# EAGLE board openbook (EAGLE 9.7.0)
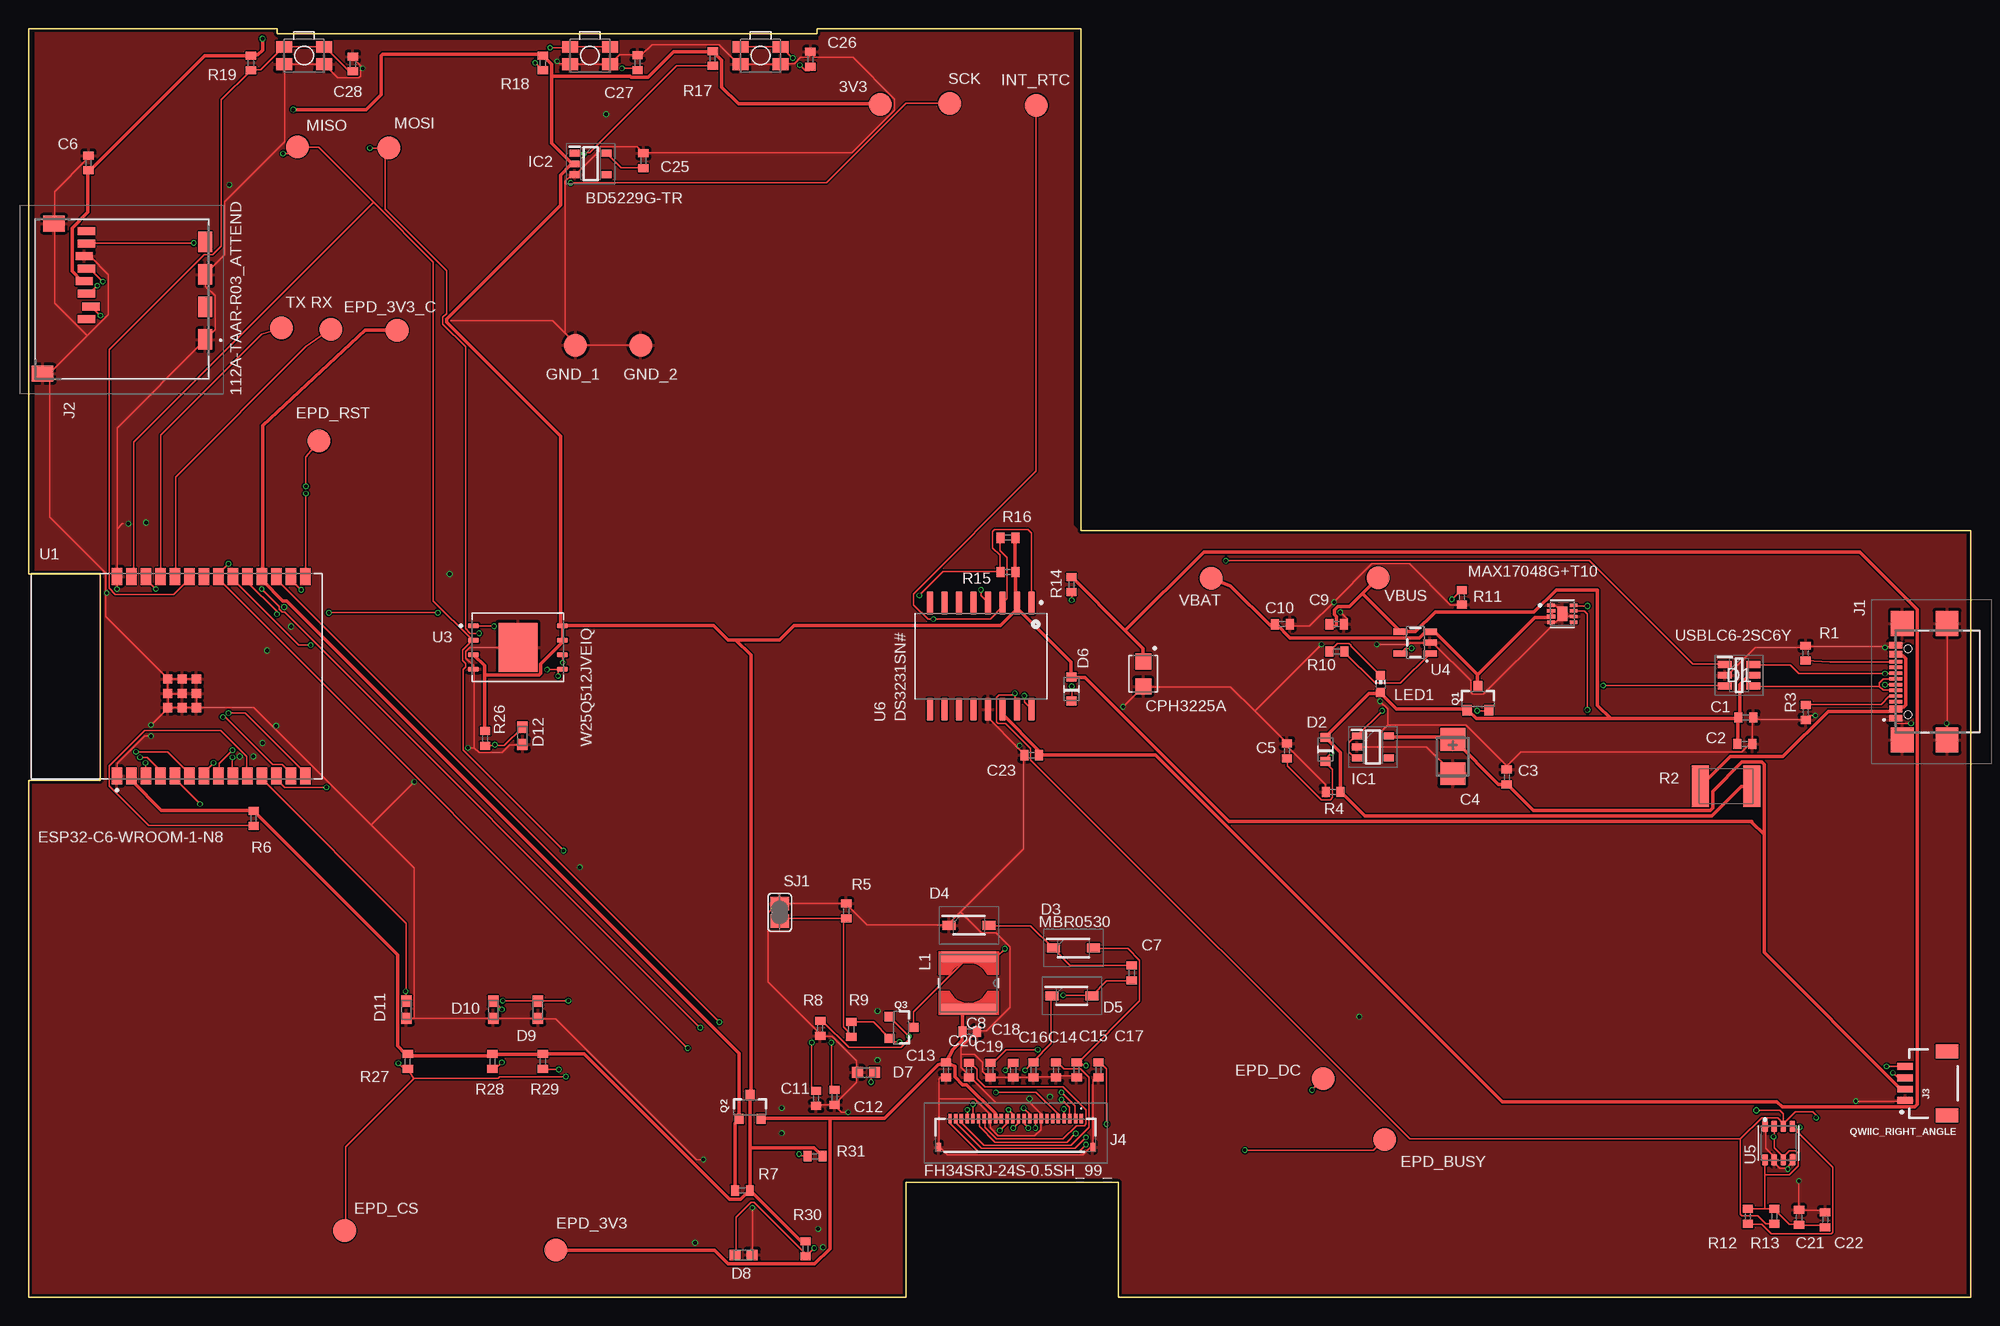
[diagram p1: board, top side]
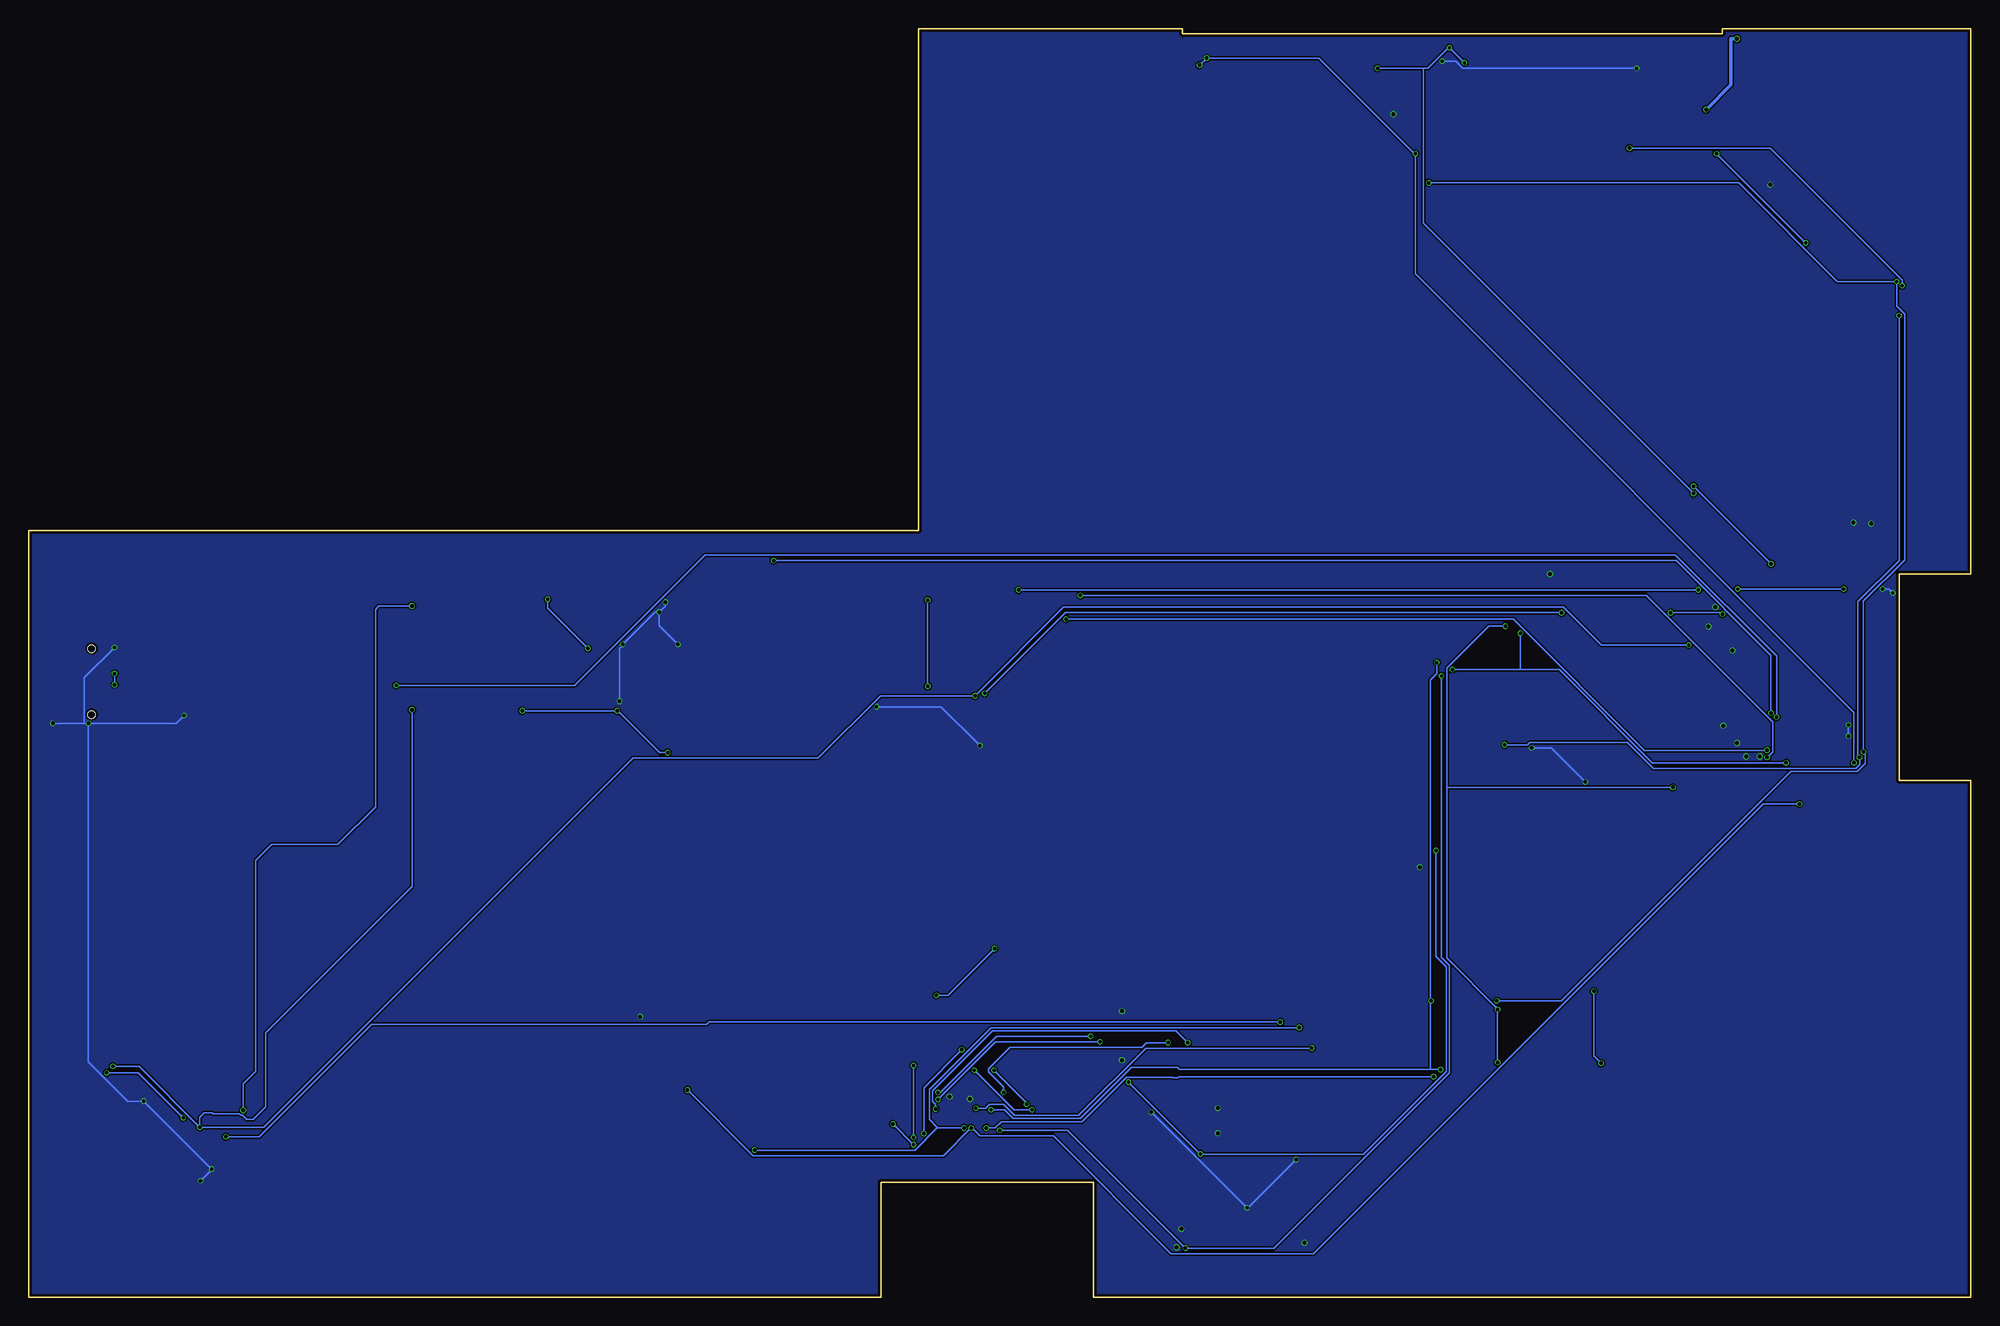
[diagram p2: board, bottom side, seen from below]

Size 170.2 x 111.2 mm. Coordinates in mm from the lower left corner, seen from the top.
Outline: 170.2,67.2 92.2,67.2 92.2,111.2 69.1,111.2 69.1,110.75 21.8,110.75 21.8,111.2 0,111.2 0,63.4 6.3,63.4 6.3,45.3 0,45.3 0,0 76.9,0 76.9,10.1 95.5,10.1 95.5,0 170.2,0 170.2,67.2
Copper layers (1*16): Top 0.035mm / dielectric 1.6mm / Bottom 0.035mm
Design rules "jlcpcb-2layers.dru *": minimum track width 5mil, minimum drill 0.3mm, track to track 5mil, track to pad 5mil, pad to pad 5mil, via to via 5mil, smd to smd 5mil, copper to edge 0.2mm, drill to drill 6mil, minimum pad ring 10mil, minimum via ring 3mil, stop-mask expansion 4mil, vias tented up to drill 0mil, thermal gap 10mil
Net classes: 0 default: width 0.15 mm; 1 POWER: width 0.3 mm

## Footprints (pad centres in the part's own frame; a part is rotated, then mirrored left to right if it is on the bottom)
EAGLE-LTSPICE_C0402 = smd 0.7 x 0.9: 1 -0.65,0; 2 0.65,0
RCL_CT3528 = smd 2 x 2.2: + -1.5,0; - 1.5,0
CAPCP3225X100N = smd 1.4 x 1.4: 1 -1.1,0; 2 1.1,0
SOT95P280X145-6N = smd 1.2 x 0.6: 1 -1.25,0.95; 2 -1.25,0; 3 -1.25,-0.95; 4 1.25,-0.95; 5 1.25,0; 6 1.25,0.95
ESP32_WROVER_AVX---SD0805S020S1R0_AVX_SD0805S020S1R0_0 = smd 0.8 x 0.9: 1 -1.05,0; 2 1.05,0
SOD3716X135N = smd 1.15 x 0.8: 1 -1.75,0; 2 1.75,0
DIOC1608X36N = smd 0.97 x 0.94: 1 -0.75,0; 2 0.75,0
SOT95P280X120-5N = smd 0.9 x 0.6: 1 -1.4,0.95; 2 -1.4,0; 3 -1.4,-0.95; 4 1.4,-0.95; 5 1.4,0.95
SOT95P280X125-5N = smd 0.9 x 0.6: 1 -1.4,0.95; 2 -1.4,0; 3 -1.4,-0.95; 4 1.4,-0.95; 5 1.4,0.95
SAMACSYS_PARTS_USB4110GFA = smd 0.3 x 1.15: A1 -3.35,3.678; A4 -2.55,3.678; A5 -1.25,3.678; A6 -0.25,3.678; A7 0.25,3.678; A8 1.25,3.678; A9 2.55,3.678; A12 3.35,3.678; B1 3.05,3.678; B4 2.25,3.678; B5 1.75,3.678; B6 0.75,3.678; B7 -0.75,3.678; B8 -1.75,3.678; B9 -2.25,3.678; B12 -3.05,3.678 | smd 2.18 x 2: MP1 -5.11,-0.827; MP2 5.11,-0.827; MP3 -5.11,3.103; MP4 5.11,3.103 | hole 0.65: -2.89,2.603; 2.89,2.603
112ATAARR03ATTEND = smd 1.8 x 1.2: G1 10.6,10.4; G2 4.9,10.4; S1 7.75,10.4; S2 2.05,10.4 | smd 1.4 x 1.9: G3 13.6,-3.85; G4 0.45,-2.85 | smd 0.7 x 1.5: P1 8.8,0; P2 7.7,0.4; P3 6.6,0; P4 5.5,-0.2; P5 4.4,0; P6 3.3,-0.2; P7 2.2,0; P8 1.1,0
JST04_1MM_RA = smd 0.6 x 1.35: 1 -1.5,0; 2 -0.5,0; 3 0.5,0; 4 1.5,0 | smd 1.2 x 2: NC1 2.8,-3.675; NC2 -2.8,-3.675
FH34SRJ24S05SH99 = smd 0.3 x 0.8: 1 5.75,1.45; 2 5.25,1.45; 3 4.75,1.45; 4 4.25,1.45; 5 3.75,1.45; 6 3.25,1.45; 7 2.75,1.45; 8 2.25,1.45; 9 1.75,1.45; 10 1.25,1.45; 11 0.75,1.45; 12 0.25,1.45; 13 -0.25,1.45; 14 -0.75,1.45; 15 -1.25,1.45; 16 -1.75,1.45; 17 -2.25,1.45; 18 -2.75,1.45; 19 -3.25,1.45; 20 -3.75,1.45; 21 -4.25,1.45; 22 -4.75,1.45; 23 -5.25,1.45; 24 -5.75,1.45 | smd 0.4 x 0.8: MP1 6.75,-1.05; MP2 -6.75,-1.05
IND_4828-WE-TPC_WRE = smd 0.889 x 4.826: 1 -2.286,0; 2 2.286,0
ADAFRUIT_CHIP-LED0603 = smd 0.8 x 0.8: A 0,-0.75; C 0,0.75
ESP32_WROVER_SPARKFUN-DISCRETESEMI_SOT23-3 = smd 0.8 x 0.9: 1 -0.95,-1; 2 0.95,-1; 3 0,1.1
ESP32_WROVER_EAGLE-LTSPICE_R0402 = smd 0.7 x 0.9: 1 -0.65,0; 2 0.65,0
ESP32C6_VARISTOR_CT/CN1812 = smd 1.5 x 3.6: 1 -2.25,0; 2 2.25,0
SJ = smd 1.168 x 1.6: 1 -0.762,0; 2 0.762,0
TP20R = smd 2 x 2: TP 0,0
XCVR_ESP32-C6-WROOM-1-N8 = smd 1.5 x 0.9: 1 -8.75,5.26; 2 -8.75,3.99; 3 -8.75,2.72; 4 -8.75,1.45; 5 -8.75,0.18; 6 -8.75,-1.09; 7 -8.75,-2.36; 8 -8.75,-3.63; 9 -8.75,-4.9; 10 -8.75,-6.17; 11 -8.75,-7.44; 12 -8.75,-8.71; 13 -8.75,-9.98; 14 -8.75,-11.25; 15 8.75,-11.25; 16 8.75,-9.98; 17 8.75,-8.71; 18 8.75,-7.44; 19 8.75,-6.17; 20 8.75,-4.9; 21 8.75,-3.63; 22 8.75,-2.36; 23 8.75,-1.09; 24 8.75,0.18; 25 8.75,1.45; 26 8.75,2.72; 27 8.75,3.99; 28 8.75,5.26 | smd 0.8 x 0.8: 29_1 -2.755,0.79; 29_2 -1.505,0.79; 29_3 -0.255,0.79; 29_4 -2.755,-0.46; 29_5 -1.505,-0.46; 29_6 -0.255,-0.46; 29_7 -2.755,-1.71; 29_8 -1.505,-1.71; 29_9 -0.255,-1.71
SON50P200X200X80-9N = smd 0.76 x 0.27: 1 -0.985,0.75; 4 -0.985,-0.75; 5 0.985,-0.75; 6 0.985,-0.25; 7 0.985,0.25; 8 0.985,0.75 | smd 0.813 x 0.305: 2 -0.985,0.25; 3 -0.985,-0.25 | smd 0.9 x 1.3: 9 0,0
SON127P600X800X80-9N = smd 0.94 x 0.44: 1 -3.895,1.905; 2 -3.895,0.635; 3 -3.895,-0.635; 4 -3.895,-1.905; 5 3.895,-1.905; 6 3.895,-0.635; 7 3.895,0.635; 8 3.895,1.905 | smd 3.4 x 4.3: 9 0,0
ESP32_WROVER_SPARKFUN-IC-POWER_SOT23-5 = smd 0.55 x 1.2: 1 -0.95,-1.3; 2 0,-1.3; 3 0.95,-1.3; 4 0.95,1.3; 5 -0.95,1.3
ESP32_WROVER_BME680_PSON80P300X300X100-8N = smd 1.016 x 0.5: 1 1.458,1.2; 2 1.458,0.4; 3 1.458,-0.4; 4 1.458,-1.2; 5 -1.458,-1.22; 6 -1.458,-0.4; 7 -1.458,0.4; 8 -1.458,1.2
SOIC127P1032X265-16N = smd 2.05 x 0.59: 1 -4.655,4.445; 2 -4.655,3.175; 3 -4.655,1.905; 4 -4.655,0.635; 5 -4.655,-0.635; 6 -4.655,-1.905; 7 -4.655,-3.175; 8 -4.655,-4.445; 9 4.655,-4.445; 10 4.655,-3.175; 11 4.655,-1.905; 12 4.655,-0.635; 13 4.655,0.635; 14 4.655,1.905; 15 4.655,3.175; 16 4.655,4.445
MYBUTTON = smd 1.4 x 1.05: 1 1.75,0.75; 2 -1.75,0.75; 3 -1.75,-0.75; 4 1.75,-0.75

## Placement (x,y rotation side)
C1  100nF  [EAGLE-LTSPICE_C0402]  150.48,50.82 0 top
C2  4.7uF  [EAGLE-LTSPICE_C0402]  150.37,48.5 0 top
C3  4.7uF  [EAGLE-LTSPICE_C0402]  129.52,45.6 90 top
C4  100uF  [RCL_CT3528]  124.79,47.4 270 top
C5  4.7uF  [EAGLE-LTSPICE_C0402]  110.27,47.9 90 top
C6  100nF  [EAGLE-LTSPICE_C0402]  5.26,99.42 90 top
C7  4.7uF/25V  [EAGLE-LTSPICE_C0402]  96.66,28.44 270 top
C8  10uF  [EAGLE-LTSPICE_C0402]  82.47,23.3 0 top
C9  4.7uF  [EAGLE-LTSPICE_C0402]  114.62,59 0 top
C10  4.7uF  [EAGLE-LTSPICE_C0402]  109.87,59 0 top
C11  1uF/50V  [EAGLE-LTSPICE_C0402]  69.01,17.44 90 top
C12  1uF/50V  [EAGLE-LTSPICE_C0402]  70.62,17.54 90 top
C13  0.1uF/50V  [EAGLE-LTSPICE_C0402]  80.4,19.94 90 top
C14  1uF/50V  [EAGLE-LTSPICE_C0402]  90.03,19.94 90 top
C15  1uF/50V  [EAGLE-LTSPICE_C0402]  91.84,19.94 90 top
C16  1uF/50V  [EAGLE-LTSPICE_C0402]  88.05,19.94 90 top
C17  1uF/50V  [EAGLE-LTSPICE_C0402]  93.76,19.94 90 top
C18  1uF/50V  [EAGLE-LTSPICE_C0402]  86.28,19.92 90 top
C19  1uF/50V  [EAGLE-LTSPICE_C0402]  84.29,19.92 90 top
C20  1uF/50V  [EAGLE-LTSPICE_C0402]  82.4,19.92 90 top
C21  100nF  [EAGLE-LTSPICE_C0402]  155.14,7.02 90 top
C22  100nF  [EAGLE-LTSPICE_C0402]  157.42,6.82 90 top
C23  100nF  [EAGLE-LTSPICE_C0402]  87.9,47.52 180 top
C24  CPH3225A  [CAPCP3225X100N]  97.69,54.64 270 top
C25  100nF  [EAGLE-LTSPICE_C0402]  53.88,99.62 90 top
C26  1uF  [EAGLE-LTSPICE_C0402]  68.51,108.5 90 top
C27  100nF  [EAGLE-LTSPICE_C0402]  53.36,108.21 90 top
C28  100nF  [EAGLE-LTSPICE_C0402]  28.42,108.1 90 top
D1  USBLC6-2SC6Y  [SOT95P280X145-6N]  149.88,54.52 0 top
D2  ESP32_WROVER_AVX---SD0805S020S1R0_AVX_SD0805S020S1R0_0_0AVX_SD0805S020S1R0_0_0  [ESP32_WROVER_AVX---SD0805S020S1R0_AVX_SD0805S020S1R0_0]  113.63,48.03 90 top
D3  MBR0530  [SOD3716X135N]  91.56,30.62 0 top
D4  MBR0530  [SOD3716X135N]  82.4,32.62 0 top
D5  MBR0530  [SOD3716X135N]  91.42,26.43 0 top
D6  ESP32_WROVER_AVX---SD0805S020S1R0_AVX_SD0805S020S1R0_0_0AVX_SD0805S020S1R0_0_0  [ESP32_WROVER_AVX---SD0805S020S1R0_AVX_SD0805S020S1R0_0]  91.38,53.33 90 top
D7  PGB1010603MR  [DIOC1608X36N]  73.38,19.72 0 top
D8  PGB1010603MR  [DIOC1608X36N]  62.66,3.72 180 top
D9  PGB1010603MR  [DIOC1608X36N]  44.64,25.22 90 top
D10  PGB1010603MR  [DIOC1608X36N]  40.72,25.22 90 top
D11  PGB1010603MR  [DIOC1608X36N]  33.1,25.22 90 top
D12  PGB1010603MR  [DIOC1608X36N]  43.28,49.22 90 top
IC1  XC6220A331MR-G  [SOT95P280X120-5N]  117.79,48.24 0 top
IC2  BD5229G-TR  [SOT95P280X125-5N]  49.25,99.34 0 top
J1  SAMACSYS_PARTS_USB4110-GF-A  [SAMACSYS_PARTS_USB4110GFA]  167.28,53.96 90 top
J2  112A-TAAR-R03_ATTEND  [112ATAARR03ATTEND]  5.08,94.55 270 top
J3  QWIIC_RIGHT_ANGLE  [JST04_1MM_RA]  164.43,18.76 90 top
J4  FH34SRJ-24S-0.5SH_99_  [FH34SRJ24S05SH99]  86.49,14.22 0 top
L1  68uH  [IND_4828-WE-TPC_WRE]  82.37,27.55 270 top
LED1  [ADAFRUIT_CHIP-LED0603]  118.46,53.75 0 top
Q1  20V/4.2A/52mΩ/1.4W  [ESP32_WROVER_SPARKFUN-DISCRETESEMI_SOT23-3]  127,52.46 0 top
Q2  20V/4.2A/52mΩ/1.4W  [ESP32_WROVER_SPARKFUN-DISCRETESEMI_SOT23-3]  63.22,16.66 0 top
Q3  20V/4.2A/52mΩ/1.4W  [ESP32_WROVER_SPARKFUN-DISCRETESEMI_SOT23-3]  76.44,23.66 270 top
R1  5k1  [ESP32_WROVER_EAGLE-LTSPICE_R0402]  155.71,56.46 90 top
R2  ESP32C6_VARISTORCN1812  [ESP32C6_VARISTOR_CT/CN1812]  148.74,44.8 0 top
R3  5k1  [ESP32_WROVER_EAGLE-LTSPICE_R0402]  155.73,51.26 90 top
R4  100K  [ESP32_WROVER_EAGLE-LTSPICE_R0402]  114.32,44.3 0 top
R5  2.2  [ESP32_WROVER_EAGLE-LTSPICE_R0402]  71.65,33.86 270 top
R6  10K  [ESP32_WROVER_EAGLE-LTSPICE_R0402]  19.73,41.98 90 top
R7  10K  [ESP32_WROVER_EAGLE-LTSPICE_R0402]  62.55,9.38 0 top
R8  10K  [ESP32_WROVER_EAGLE-LTSPICE_R0402]  69.37,23.58 90 top
R9  0.47  [ESP32_WROVER_EAGLE-LTSPICE_R0402]  72.09,23.5 90 top
R10  200  [ESP32_WROVER_EAGLE-LTSPICE_R0402]  114.63,56.6 0 top
R11  2K  [ESP32_WROVER_EAGLE-LTSPICE_R0402]  125.59,61.36 90 top
R12  10K  [ESP32_WROVER_EAGLE-LTSPICE_R0402]  150.65,7.1 90 top
R13  10K  [ESP32_WROVER_EAGLE-LTSPICE_R0402]  152.97,7.1 90 top
R14  15  [ESP32_WROVER_EAGLE-LTSPICE_R0402]  91.39,62.48 90 top
R15  10K  [ESP32_WROVER_EAGLE-LTSPICE_R0402]  85.81,63.58 0 top
R16  10K  [ESP32_WROVER_EAGLE-LTSPICE_R0402]  85.83,66.58 0 top
R17  10K  [ESP32_WROVER_EAGLE-LTSPICE_R0402]  59.95,108.58 90 top
R18  10K  [ESP32_WROVER_EAGLE-LTSPICE_R0402]  45.07,108.18 90 top
R19  10K  [ESP32_WROVER_EAGLE-LTSPICE_R0402]  19.49,108.18 90 top
R26  10K  [ESP32_WROVER_EAGLE-LTSPICE_R0402]  40.01,48.98 90 top
R27  10K  [ESP32_WROVER_EAGLE-LTSPICE_R0402]  33.23,20.68 90 top
R28  10K  [ESP32_WROVER_EAGLE-LTSPICE_R0402]  40.65,20.68 90 top
R29  10K  [ESP32_WROVER_EAGLE-LTSPICE_R0402]  45.07,20.68 90 top
R30  10K  [ESP32_WROVER_EAGLE-LTSPICE_R0402]  68.09,4.28 90 top
R31  10K  [ESP32_WROVER_EAGLE-LTSPICE_R0402]  68.91,12.38 0 top
SJ1  [SJ]  65.82,33.74 270 top
TP1  TPTP20R  [TP20R]  22.17,84.96 0 top
TP2  TPTP20R  [TP20R]  26.49,84.84 0 top
TP3  TPTP20R  [TP20R]  103.61,63.04 0 top
TP4  TPTP20R  [TP20R]  47.93,83.44 0 top
TP5  TPTP20R  [TP20R]  53.65,83.44 0 top
TP6  TPTP20R  [TP20R]  23.57,100.84 0 top
TP7  TPTP20R  [TP20R]  31.59,100.74 0 top
TP8  TPTP20R  [TP20R]  80.71,104.64 0 top
TP9  TPTP20R  [TP20R]  118.83,13.84 0 top
TP10  TPTP20R  [TP20R]  27.7,5.86 0 top
TP11  TPTP20R  [TP20R]  113.45,19.16 0 top
TP12  TPTP20R  [TP20R]  25.45,75.06 0 top
TP13  TPTP20R  [TP20R]  32.3,84.76 0 top
TP14  TPTP20R  [TP20R]  118.25,63.06 0 top
TP15  TPTP20R  [TP20R]  88.3,104.46 0 top
TP16  TPTP20R  [TP20R]  74.65,104.56 0 top
TP17  TPTP20R  [TP20R]  46.2,4.16 0 top
U1  ESP32-C6-WROOM-1-N8  [XCVR_ESP32-C6-WROOM-1-N8]  13,54.44 90 top
U2  MAX17048G+T10  [SON50P200X200X80-9N]  134.4,59.92 0 top
U3  W25Q512JVEIQ  [SON127P600X800X80-9N]  42.89,56.96 0 top
U4  ESP32_WROVER_SPARKFUN-IC-POWER_MCP73831  [ESP32_WROVER_SPARKFUN-IC-POWER_SOT23-5]  121.51,57.39 90 top
U5  ESP32_WROVER_BME680_BME680  [ESP32_WROVER_BME680_PSON80P300X300X100-8N]  153.35,13.53 90 top
U6  DS3231SN#  [SOIC127P1032X265-16N]  83.45,56.2 270 top
U$1  BUTTON_CUSYOMV1  [MYBUTTON]  64.14,108.83 180 top
U$2  BUTTON_CUSYOMV1  [MYBUTTON]  49.19,108.83 180 top
U$3  BUTTON_CUSYOMV1  [MYBUTTON]  24.14,108.83 180 top

## Tracks (layer width: path | path; a pad name or v marks a point on that pad's centre or on a via)
3V3  (via drill 0.35)
  Top 0.3: J2.P4 4.85,89.09 4.64,89.09 3.81,89.92 3.81,93.73 5.19,95.11 5.19,98.71 C6.1 5.4,98.78 15.44,108.82 19.46,108.82 R19.2 19.6,108.89 20.08,108.89 20.5,109.31 v20.5,110.3 | 45.84,107.02 45.84,108.06 R18.2 44.97,108.93 31.03,108.93 30.9,108.8 30.9,105.4 29.6,104.1 v23.2,104.1 | 45.84,107.02 45.84,101.14 47.57,99.4 47.78,99.4 IC2.2 47.5,99.27 46.6,98.37 46.6,95.7 36.65,85.75 36.65,85.45 46.6,75.5 46.6,59.03 46.67,58.96 U3.8 | TP16.TP 74.65,104.6 62.19,104.6 60.73,106.06 60.73,108.41 60.04,109.1 R17.2 59.9,109.17 56.51,109.17 54.27,106.93 52.8,106.93 52.7,107.02 45.84,107.02 | IC1.5 119.25,49.13 124.58,49.13 124.79,48.92 C4.+ 124.93,48.85 128.8,44.97 129.5,44.97 C3.1 129.63,44.91 131.85,42.69 147.36,42.69 147.57,42.9 147.57,44.35 150.13,46.91 151.86,46.91 152.07,46.71 152.07,40.57 | 152.07,40.57 152.07,30.22 163.98,18.31 164.4,18.31 J3.2 | U3.8 46.81,58.82 46.81,57.65 U3.7 46.67,57.51 46.67,57.3 44.87,55.5 44.87,54.67 44.73,54.53 39.96,54.53 | 39.96,54.53 39.96,55.36 39.06,56.26 U3.3 | 39.96,54.53 39.96,49.68 R26.2 | U6.2 86.63,60.83 86.63,60.42 91.34,55.71 91.34,54.39 D6.2 91.48,54.32 92.59,54.32 105.19,41.72 151,41.72 151,41.64 152.07,40.57 | U6.2 86.49,60.9 86.49,63.53 R15.2 86.42,63.67 86.42,66.58 R16.2 | U3.8 46.95,58.89 60.02,58.89 61.28,57.62 61.95,57.62 | U6.2 86.56,60.28 85.18,58.89 67.09,58.89 65.82,57.62 61.95,57.62 | U1.2 9.07,45.67 9.07,45.25 11.63,42.69 19.66,42.69 R6.2 19.8,42.55 32.34,30.02 32.34,22.05 33.02,21.37 R27.2 33.55,21.15 40.64,21.15 R28.2 40.67,21.29 45.01,21.29 R29.2 45.22,21.36 48.68,21.36 61.42,8.62 62.39,8.62 63.09,9.31 R7.2
  Top 0.3: R30.2 68.07,4.95 67.66,4.95 63.22,9.38 R7.2 | 63.22,13.12 63.22,9.52 R7.2 | 63.22,13.12 Q2.3 63.29,17.9 63.29,56.28 61.95,57.62 | 63.22,13.12 68.83,13.12 69.53,12.43 R31.2
  Bottom 0.3: v23.2,104.1 21.03,106.27 21.03,110.3 v20.5,110.3
32KHZ  (via drill 0.3)
  Top 0.15: U6.1 87.88,60.9 87.88,66.97 87.57,67.27 84.62,67.27 84.48,67.13 84.48,65.68 85.11,65.06 85.11,63.6 R15.1 85.04,63.6 80.12,63.6 v78.04,61.53 | v17.87,47.33 17.87,45.74 U1.9
  Bottom 0.15: v17.87,47.33 17.38,47.81 17.38,50.45 28.46,61.53 v78.04,61.53
DN
  Top 0.15: 162.18,53.56 162.53,53.22 163.57,53.22 J1.B7 | 162.18,53.56 162.18,53.84 162.53,54.18 163.57,54.18 J1.A7 | 162.18,53.56 151.17,53.56 D1.4
DP  (via drill 0.3)
  Top 0.15: v162.67,53.7 163.57,53.7 J1.A6 | J1.B6 163.57,54.67 v162.67,54.67 155.12,54.67 154.36,55.43 151.17,55.43 D1.6
  Bottom 0.15: v162.67,54.67 v162.67,53.7
EPD_3V3
  Top 0.3: L1.2 82.34,25.24 81.85,24.75 81.85,23.37 C8.1 81.78,23.16 81.78,22.54 80.99,21.74 C13.2 | J4.15 85.18,15.68 84.76,15.68 J4.16 84.69,15.82 84.69,16.16 82.21,18.64 81.84,18.64 81.16,19.32 81.16,20.24 C13.2 | 70.22,15.68 75,15.68 79.68,20.37 C13.2 | 70.22,15.68 64.19,15.68 Q2.2 | TP17.TP 46.26,4.12 60.11,4.12 61.28,2.94 68.89,2.94 70.22,4.27 70.22,15.68
EPD_3V3_C
  Top 0.3: R7.1 61.91,9.45 61.91,15.27 62.25,15.61 Q2.1 62.25,15.82 62.25,21.39 22.62,61.03 22.28,61.03 20.5,62.81 20.5,63.05 U1.18 20.5,63.26 20.5,76.39 29.48,84.76 TP13.TP
EPD_BUSY  (via drill 0.3)
  Top 0.15: v88.22,14.85 88.22,15.61 J4.9 | v106.57,12.91 117.86,12.91 118.76,13.81 TP9.TP | v11.15,62.08 10.32,62.91 10.32,63.19 U1.26 | v20.43,62.08 21.95,60.56 21.95,60.31 22.21,60.05 22.46,60.05 v58.86,23.65
  Bottom 0.15: 90.58,14.85 v88.22,14.85 | 90.58,14.85 92.52,12.91 v106.57,12.91 | v20.43,62.08 v11.15,62.08 | v58.86,23.65 85.87,23.65 91.27,18.24 91.27,15.61 90.58,14.92 90.58,14.85
EPD_CS  (via drill 0.3)
  Top 0.15: 33.1,26.83 33.1,32.79 20.5,45.39 20.5,45.67 U1.11 | 33.1,26.83 D11.2 | v86.28,14.85 86.7,15.27 86.7,15.61 J4.12 | v47.09,19.35 41.27,19.35 41.13,19.21 33.74,19.21 | 33.74,19.21 33.72,19.21 33.72,19.14 27.77,13.19 27.77,5.92 TP10.TP | 33.74,19.21 R27.1 32.82,20.12 v32.41,20.53 | v33.03,26.83 33.1,26.83
  Bottom 0.15: v86.28,14.85 85.52,14.85 84.97,15.4 77.91,15.4 74.01,19.3 69.94,19.3 69.89,19.25 69.51,19.25 69.41,19.35 v47.09,19.35 | v33.03,26.83 33.03,21.15 v32.41,20.53
EPD_DC  (via drill 0.3)
  Top 0.15: v87.6,14.85 87.25,15.2 87.25,15.61 J4.11 | v112.46,18.17 113.43,19.14 TP11.TP | v15.03,43.24 12.88,45.39 12.88,45.67 U1.5
  Bottom 0.15: v112.46,18.17 106.71,12.43 90.02,12.43 v87.6,14.85 87.53,14.85 86.84,14.16 80.4,14.16 70.08,3.84 57.62,3.84 18.21,43.24 v15.03,43.24
EPD_RST  (via drill 0.3)
  Top 0.15: v87.18,16.58 87.74,16.03 J4.10 | v57.75,21.85 16.69,62.91 16.69,63.19 U1.21 16.69,63.26 16.69,63.46 v17.52,64.3 | v24.3,71.08 24.3,73.66 TP12.TP
  Bottom 0.15: v87.18,16.58 86.35,16.58 86.01,16.93 84.76,16.93 83.79,15.96 78.18,15.96 72.3,21.85 v57.75,21.85 | v17.52,64.3 v24.3,71.08
FLASH_CS  (via drill 0.3)
  Top 0.15: v41.48,20.6 40.94,20.06 R28.1 | v41.48,25.24 40.79,25.93 D10.2 | v40.79,58.82 39.06,58.82 U3.1 | v26.11,44.7 22.44,44.7 21.74,45.39 21.74,45.67 U1.12
  Bottom 0.15: v41.48,20.6 v41.48,25.24 41.48,25.31 45.91,29.74 45.91,44.7 | v40.79,58.82 42.24,58.82 45.91,55.15 45.91,44.7 | 45.91,44.7 v26.11,44.7
GDR  (via drill 0.3)
  Top 0.15: v90.51,17.97 91.69,16.79 91.69,15.68 J4.2 | Q3.1 75.48,24.55 v77.14,22.88 77.14,22.61 76.45,21.91 71.88,21.91 69.59,24.2 69.39,24.2 R8.2
  Bottom 0.15: v90.51,17.97 90.3,17.97 85.38,22.88 v77.14,22.88
GND  (via drill 0.3, 0.35)
  Top 0.15: C22.2 157.4,7.51 157.27,7.65 155.19,7.65 C21.2 155.12,7.72 v155.12,10.21 | 154.01,11.32 153.46,11.32 152.97,11.8 152.97,12.01 U5.7 152.9,12.08 152.9,12.36 152.21,13.05 152.21,14.92 U5.1 | 154.01,11.32 154.56,11.87 154.56,12.01 U5.5 | v160.1,17.2 164.4,17.2 J3.1 | v154.15,11.25 154.08,11.32 154.01,11.32 | J1.B12 163.64,50.86 163.64,50.65 J1.A1 163.64,50.58 163.64,50.31 | 163.64,50.31 163.64,49.34 164.12,48.85 J1.MP3 | 168.14,50.31 168.14,59.03 J1.MP2 | 168.14,50.31 168.14,48.85 J1.MP1 | v164.95,50.31 163.64,50.31 | v168.07,50.31 168.14,50.31 | J1.MP4 164.12,59.03 163.64,58.55 163.64,57.37 J1.A12 163.64,57.3 163.64,57.02 J1.B1 163.57,57.02 162.67,57.02 | D1.2 148.68,54.53 148.89,54.53 151.31,56.95 155.65,56.95 R1.2 156.01,57.02 162.67,57.02 | v162.67,56.95 162.67,57.02 | 118.48,48.23 122.5,48.23 124.79,45.94 C4.- | 118.48,48.23 116.41,48.23 IC1.2 | 129.5,46.64 129.5,46.29 C3.2 | 129.5,46.64 125.96,50.17 119.11,50.17 | 119.11,50.17 118.48,49.54 118.48,48.23 | 129.5,46.64 129.56,46.64 130.74,47.81 150.13,47.81 150.76,48.44 150.96,48.44 C2.2 151.03,48.51 151.03,50.72 151.1,50.79 C1.2 151.1,50.65 155.67,50.65 R3.1 155.74,50.65 156.09,51 v156.57,51 | R4.1 113.64,44.35 113.64,44.97 110.31,48.3 110.31,48.51 C5.2 110.24,48.58 107.44,51.38 | 107.44,51.38 105.33,53.49 97.71,53.49 C24.2 97.64,53.49 v95.91,51.76 | 114.37,60.94 117.72,64.3 120.98,64.3 124.58,60.69 125.55,60.69 R11.1 | 114.37,60.94 112.25,58.82 110.59,58.82 C10.2 | v114.95,60.06 115.57,59.44 C9.2 | U2.9 134.43,59.78 133.82,59.17 133.44,59.17 U2.4 133.37,59.1 133.37,58.76 127.49,52.87 126.52,52.87 126.38,53.01 126.38,54.05 123.06,57.37 122.85,57.37 U4.2 122.78,57.37 121.05,57.37 120.91,57.23 v118.14,57.23
  Top 0.15: U2.6 135.38,59.72 134.62,59.72 134.48,59.86 U2.9 | U2.1 133.44,60.62 133.79,60.62 134.48,59.93 U2.9 | 107.44,51.38 v113.29,57.23 | 119.11,50.17 119.11,51.55 v118.42,52.25 | TP5.TP 51.35,83.44 47.99,83.48 TP4.TP 47.99,83.55 47.02,84.52 47.02,97.81 47.57,98.37 47.78,98.37 IC2.3 47.85,98.44 47.99,98.44 50,100.44 50,100.72 50.14,100.86 53.32,100.86 53.88,100.31 C25.2 53.94,100.31 72.16,100.31 75.9,104.04 75.9,105.01 72.23,108.68 68.89,108.68 C26.2 68.4,108.68 67.66,108.68 67.1,108.13 65.92,108.13 U$1.2 65.86,108.06 62.39,108.06 U$1.1 62.32,108.13 62.18,108.13 60.52,109.79 54.64,109.79 53.73,108.88 C27.2 53.35,108.89 51.8,108.89 50.97,108.06 U$2.2 50.9,108.06 47.5,108.06 U$2.1 47.43,108.13 46.53,108.13 v46.33,108.34 | 29.08,107.72 29.08,107.02 28.95,106.88 27.08,106.88 25.9,108.06 U$3.2 25.83,108.06 22.44,108.06 U$3.1 22.44,107.99 22.44,101.27 17.17,96.01 17.17,91.37 15.51,89.71 J2.G2 15.51,89.64 15.51,88.6 16.34,87.77 16.34,84.79 15.51,83.96 J2.G1 15.44,83.89 7.75,76.21 7.75,67.35 7.75,63.26 U1.28 7.75,63.12 v7.75,62.08 | 29.08,107.72 29.08,107.92 28.46,108.55 28.46,108.68 C28.2 | 29.08,107.72 v29.29,107.72 | C11.1 69.04,16.86 70.56,16.86 C12.1 | v63.43,7.86 63.43,3.77 D8.1 | v71.81,16.23 71.26,16.23 70.63,16.86 C12.1 | C12.1 70.63,16.93 72.57,18.87 72.57,19.7 D7.1 72.57,19.77 72.57,20.74 70.43,22.88 69.39,22.88 R8.1 69.32,22.95 69.32,23.16 64.82,27.66 64.82,33.69 65.58,34.45 65.79,34.45 SJ1.1 65.86,34.52 71.6,34.52 R5.1 71.67,34.45 73.47,32.65 80.61,32.65 D4.1 80.61,32.72 81.68,33.79 | 81.71,21.29 81.71,21.91 83.1,23.3 C8.2 83.17,23.37 83.93,23.37 85.98,25.42 85.98,30.74 84.77,31.96 83.51,31.96 81.68,33.79
  Top 0.15: C15.1 91.77,19.42 90.3,19.42 C14.1 90.02,19.35 88.08,19.35 C16.1 88.02,19.28 86.35,19.28 C18.1 C19.1 84.12,19.3 83.58,19.84 83.58,20.6 82.89,21.29 81.71,21.29 | C17.1 93.49,19.29 93.28,19.07 93.28,13.19 J4.MP1 93.21,13.12 93,13.12 92.38,12.5 80.54,12.5 79.84,13.19 J4.MP2 79.77,13.19 79.77,17.41 | 79.77,17.41 79.77,19.14 79.92,19.29 C13.1 | 79.77,17.41 82.89,17.41 84.21,16.1 84.21,15.68 J4.17 84.28,15.61 84.28,14.85 84.97,14.16 88.15,14.16 88.71,14.71 88.71,15.61 J4.8 88.71,15.68 88.71,16.1 87.74,17.07 84.76,17.07 82.61,19.22 C20.1 82.34,19.32 82.34,19.55 81.71,20.17 81.71,21.29 | 86.67,48.19 84.14,50.72 84.14,51.48 U6.13 | 86.67,48.19 87.18,47.68 87.18,47.54 C23.2 87.18,47.47 87.18,39.3 81.68,33.79 | C6.2 5.19,100.03 5.19,99.82 2.28,96.91 2.28,94.14 J2.G4 2.28,94.07 2.28,87.15 5.16,84.27 | 5.16,84.27 1.87,80.98 1.25,80.98 J2.G3 1.87,80.92 1.87,68.38 6.79,63.46 6.79,61.73 | 5.16,84.27 6.99,86.11 6.99,89.64 5.4,91.23 4.92,91.23 J2.P6 | U3.9 42.86,56.95 38.64,56.95 38.29,56.61 38.29,56.05 38.99,55.36 38.99,55.08 U3.4 39.06,55.02 39.06,48.16 | 39.06,48.16 39.47,47.74 41.48,47.74 42.17,48.44 43.28,48.44 D12.1 | 33.79,24.48 D10.1 40.79,24.48 44.6,24.48 D9.1 44.66,24.41 46.19,24.41 58.52,12.08 v59.14,12.08 | 33.79,24.48 D11.1 | U1.29_3 12.26,54.18 13.43,54.18 U1.29_6 13.5,54.18 14.68,54.18 U1.29_9 | U1.29_7 14.75,51.69 14.75,52.87 U1.29_8 | U1.29_1 12.26,51.69 12.26,52.87 U1.29_2 | U1.29_1 12.32,51.69 13.43,51.69 U1.29_4 13.5,51.69 14.68,51.69 U1.29_7 | U1.29_5 13.43,52.87 12.32,52.87 U1.29_2 | v10.73,49.2 10.18,49.2 7.75,46.78 7.75,45.74 U1.1
  Top 0.15: v10.73,50.17 12.19,51.62 U1.29_1 | U1.29_3 12.19,54.12 12.19,53.01 U1.29_2 | 33.79,24.48 33.79,37.63 30.02,41.41 | 30.02,41.41 19.73,51.69 14.82,51.69 U1.29_7 | v38.5,48.16 39.06,48.16 | 30.02,41.41 v33.79,45.18 | 6.79,61.73 6.79,59.66 12.19,54.25 U1.29_3 | v6.85,61.73 6.79,61.73 | 86.67,48.19 v86.84,48.37 | v114.38,60.92 114.37,60.94
  Top 0.152: 47.99,83.55 45.93,85.6 37,85.6 | 7.75,67.35 8.21,67.8 8.3,67.8
  Bottom 0.15: v155.12,10.21 154.15,11.18 v154.15,11.25 v160.1,17.2 161.49,17.2 164.95,20.67 v164.95,50.31 | v168.07,50.31 165.3,50.31 | 165.3,50.31 v164.95,50.31 | 165.3,50.31 165.3,54.32 v162.67,56.95 | v114.95,60.06 114.4,60.6 114.4,60.9 v114.38,60.92 | v114.95,60.06 115.32,60.06 v118.14,57.23 118.14,57.16 118.42,56.89 v118.42,52.25 | v113.29,57.23 114.95,58.89 v114.95,60.06 | v164.95,50.31 157.27,50.31 v156.57,51 | v46.33,108.34 45.15,108.34 44.53,107.72 v29.29,107.72 | v71.81,16.23 v63.43,7.86 63.36,7.86 v59.14,12.08 | v10.73,50.17 v10.73,49.2 | v38.5,48.16 36.77,48.16 v33.79,45.18 | v7.75,62.08 7.2,62.08 v6.85,61.73 | v95.91,51.76 90.23,51.76 v86.84,48.37
  other vias: 10.3,67.9 8.75,67.8 23,58.8 20.9,56.7 20.5,48.6 21.7,50.1 18.5,47.4 19.7,47.4 22.4,60.5 66,14.4 66,16.6 74.4,25.1 74.4,20.8 69.6,4.4 69.2,6 116.6,24.6 58.4,4.8 48.3,37.7 36.9,63.4 17.6,97.5 50.6,103.7 89.5,17.6 87.7,17.4
  pour Top: 95.66,10.24 95.68,10.22 95.68,-0.12 169.82,-0.12 169.74,-0.04 169.72,-0.02 169.72,67.12 92.08,67.12 92.06,67.14 91.54,67.66 91.52,67.68 91.52,110.92 69.38,110.92 69.36,110.94 69.28,111.02 69.28,110.18 69.26,110.16 69.24,110.14 69.22,110.12 21.98,110.12 21.96,110.14 21.64,110.46 21.62,110.48 21.62,110.57 21.27,110.92 0.28,110.92 0.33,110.88 0.52,110.88 0.54,110.86 0.56,110.84 0.58,110.82 0.58,63.58 6.12,63.58 6.14,63.56 6.66,63.04 6.68,63.02 6.68,45.48 6.66,45.46 6.64,45.44 6.62,45.42 0.08,45.42 0.08,0.38 76.62,0.38 76.62,10.32 76.64,10.34 76.76,10.46 76.78,10.48 95.42,10.48 95.44,10.46
  pour Bottom: 0.17,45.32 0.18,45.32 0.18,-0.02 0.36,0.16 0.38,0.18 76.72,0.18 76.72,9.92 76.74,9.94 76.96,10.16 76.98,10.18 95.52,10.18 95.54,10.16 95.66,10.04 95.68,10.02 95.68,0.23 95.83,0.08 170.12,0.08 170.12,67.12 92.08,67.12 92.06,67.14 92.04,67.16 92.02,67.18 92.02,67.22 92.04,67.24 92.12,67.33 92.12,111.12 92.04,111.04 92.02,111.02 69.33,111.02 69.18,110.87 69.18,110.28 69.16,110.26 69.14,110.24 69.12,110.22 69.08,110.22 69.06,110.24 68.87,110.42 21.88,110.42 21.86,110.44 21.84,110.46 21.82,110.48 21.82,110.67 21.5,110.99 21.34,110.84 21.32,110.82 0.33,110.82 -0.02,110.47 -0.02,63.73 0.03,63.68 6.22,63.68 6.24,63.66 6.46,63.44 6.48,63.42 6.48,45.38 6.46,45.36 6.44,45.34 6.42,45.32
GPIO8
  Top 0.15: R6.1 19.66,41.37 10.53,41.37 7.06,44.84 7.06,46.57 10.18,49.68 16.86,49.68 19.11,47.43 19.11,45.74 U1.10
I2C_PW  (via drill 0.3)
  Top 0.15: C22.1 157.4,6.19 157.27,6.33 155.19,6.33 C21.1 155.12,6.4 154.29,6.4 152.97,7.72 R13.2 152.9,7.79 152.14,7.79 | 152.14,7.79 150.69,7.79 R12.2 | 152.14,7.79 152.14,10.76 | 152.14,10.76 152.14,12.01 U5.8 | 152.97,14.09 152.97,13.12 153.73,12.36 153.73,12.08 U5.6 153.8,12.36 154.29,12.84 154.84,12.84 155.05,12.63 155.05,11.53 154.29,10.76 152.14,10.76 | 152.97,14.09 152.97,14.92 U5.2 | v60.52,24.13 21.74,62.91 21.74,63.19 U1.17 | v152.9,14.09 152.97,14.09
  Bottom 0.15: v152.9,14.09 149.99,14.09 140.14,23.95 110.79,23.95 110.59,24.15 110.21,24.15 110.19,24.13 v60.52,24.13
INT_RTC  (via drill 0.3)
  Top 0.15: R16.1 85.11,66.58 85.11,65.47 85.73,64.85 85.73,61.25 85.38,60.9 U6.3 85.32,60.83 85.32,60.49 84.28,59.45 v79.29,59.45 78.81,59.45 77.56,60.69 77.56,61.66 88.29,72.4 88.29,104.4 TP15.TP | v17.87,47.95 16.69,46.78 16.69,45.74 U1.8
  Bottom 0.15: v17.87,47.95 28.6,47.95 40.09,59.45 v79.29,59.45
IO/BOOT  (via drill 0.3)
  Top 0.15: v44.39,108.2 45.01,107.58 R18.1 | v45.7,109.52 47.43,109.52 U$2.4 47.5,109.58 50.9,109.58 U$2.3 | v52,107.72 53.3,107.72 C27.1 | v24.3,70.46 24.3,63.26 U1.15
  Bottom 0.15: v44.39,108.2 v45.7,109.52 45.77,109.52 47.57,107.72 47.99,107.72 | 47.99,107.72 v52,107.72 | v24.3,70.46 47.99,94.14 47.99,107.72
IO/CHANGE
  Top 0.15: C28.1 28.39,107.51 28.05,107.51 26.04,109.52 25.9,109.52 U$3.3 25.83,109.58 22.44,109.58 U$3.4 22.37,109.58 20.36,107.58 19.53,107.58 R19.1 19.46,107.51 16.89,104.94 16.89,92.13 16.13,91.37 15.37,91.37 7.06,83.06 7.06,62.15 7.62,61.59 12.74,61.59 14.06,62.91 14.06,63.19 U1.23
MISO  (via drill 0.3)
  Top 0.15: v67.52,12.56 67.66,12.43 68.21,12.43 R31.1 | v73.82,18.87 73.82,19.42 74.1,19.7 D7.2 | 30.23,95.98 25.41,100.79 23.61,100.79 TP6.TP 23.54,100.79 22.99,100.23 v22.3,100.23 | 30.23,95.98 35.45,90.75 35.45,61.04 38.85,57.65 38.99,57.65 U3.2 38.85,57.58 38.02,56.75 38.02,55.82 38.28,55.56 38.28,55.24 38.07,55.04 38.07,47.96 v46.88,39.16 | v14.47,92.41 5.12,92.41 J2.P7 | 30.23,95.98 9.21,74.96 9.21,63.39 U1.27
  Bottom 0.15: v73.82,18.87 v67.52,12.56 53.25,12.56 45.98,19.84 45.98,28.98 46.88,29.88 v46.88,39.16 | v22.3,100.23 v14.47,92.41
MOSI  (via drill 0.3)
  Top 0.15: v6.02,88.67 5.33,87.98 5.12,87.98 J2.P3 | v29.91,100.72 31.55,100.72 TP7.TP 31.23,100.7 31.23,95.39 36.63,89.98 36.63,86.23 36.3,85.89 36.3,85.31 38.29,83.31 38.29,58.62 38.71,58.2 v39.47,58.2 | v85.11,14.64 85.73,15.27 85.73,15.61 J4.14 | 68.21,3.7 68.14,3.63 R30.1 68.21,3.7 | 68.21,3.7 v68.83,4.32 | 68.21,3.7 63.57,8.34 63.29,8.34 61.98,7.03 61.98,3.77 D8.2 | v45.43,55.02 46.74,55.02 U3.5 46.4,54.95 v46.4,54.46 | v16.2,46.84 15.37,46.01 15.37,45.74 U1.7
  Bottom 0.15: v6.02,88.67 6.02,89.16 17.59,100.72 v29.91,100.72 | v85.11,14.64 79.15,14.64 v68.83,4.32 61.08,4.32 45.7,19.7 45.7,29.12 46.4,29.81 v46.4,54.46 | 39.47,55.02 36.08,55.02 27.91,46.84 v16.2,46.84 | 39.47,55.02 v45.43,55.02 | 39.47,55.02 v39.47,58.2
N$1  (via drill 0.3)
  Top 0.15: v91.41,53.56 91.41,52.31 D6.1 | v91.41,61.11 91.41,61.8 R14.1
  Bottom 0.15: v91.41,61.11 v91.41,53.56
N$5
  Top 0.15: R1.1 157.85,55.71 163.57,55.71 J1.B5
N$8
  Top 0.15: R3.2 155.74,51.97 162.32,51.97 163.01,52.66 163.57,52.66 J1.A5
N$12  (via drill 0.3)
  Top 0.15: C5.1 110.31,47.19 110.31,46.57 113.29,43.59 114.05,43.59 114.26,43.8 114.26,46.29 113.64,46.91 D2.1 113.64,47.05 113.64,47.19 v114.19,47.74 | IC1.3 116.34,47.33 116.2,47.33 115.72,47.81 115.72,48.64 116.2,49.13 116.34,49.13 IC1.1 116.41,49.2 v118.62,51.41 | v126.93,51.41 127.9,51.41 Q1.2
  Bottom 0.15: v126.93,51.41 v118.62,51.41 118.55,51.41 114.88,47.74 v114.19,47.74
N$59
  Top 0.15: C7.1 96.6,29.12 91.27,29.12 89.82,30.57 D3.1 89.75,30.64 87.81,32.58 84.21,32.58 D4.2
N$66
  Top 0.15: LED1.C 118.42,54.53 115.85,57.09 115.85,57.16 115.72,57.3 114.68,57.3 R10.1
N$68
  Top 0.15: R10.2 115.3,56.54 118,53.84 120.22,53.84 122.78,56.4 U4.1
N$69  (via drill 0.3)
  Top 0.15: v124.72,61.18 125.55,62.01 R11.2 | v121.19,56.89 120.63,56.89 120.22,56.47 U4.5
  Bottom 0.15: v124.72,61.18 124.72,60.42 v121.19,56.89
N$73  (via drill 0.3)
  Top 0.15: v90.72,16.51 90.72,15.68 J4.4 | v68.62,22.33 68.62,18.45 68.97,18.11 C11.2
  Bottom 0.15: v90.72,16.51 90.72,16.93 90.99,17.2 90.99,18.11 85.73,23.37 69.66,23.37 v68.62,22.33
N$74  (via drill 0.3)
  Top 0.15: v84.76,17.97 88.29,17.97 90.23,16.03 J4.5 | v70.36,22.33 70.36,18.45 70.56,18.24 C12.2
  Bottom 0.15: v84.76,17.97 84.76,18.45 86.08,19.77 86.08,20.04 84.21,21.91 72.64,21.91 72.23,22.33 v70.36,22.33
N$82
  Top 0.15: J4.18 83.79,15.61 83.79,14.92 84.83,13.88 90.65,13.88 91.82,15.06 92.52,15.06 92.66,15.2 92.66,16.44 90.65,18.45 83.79,18.45 83.1,19.14 83.1,19.98 82.59,20.48 C20.2
N$83  (via drill 0.3)
  Top 0.15: v91.76,14.37 90.99,13.6 84.69,13.6 83.31,14.99 83.31,15.61 J4.19 | v88.43,21.71 85.66,21.71 84.66,20.71 C19.2
  Bottom 0.15: v91.76,14.37 91.76,18.38 v88.43,21.71
N$84  (via drill 0.3)
  Top 0.15: v82.75,16.93 82.75,15.68 J4.20 | v85.59,19.91 86.22,20.53 C18.2
  Bottom 0.15: v82.75,16.93 82.75,17.07 v85.59,19.91
N$86
  Top 0.15: J4.22 81.78,15.61 81.78,15.27 83.72,13.33 91.34,13.33 92.93,14.92 92.93,19.28 92.18,20.04 90.72,20.04 90.25,20.51 C14.2
N$88  (via drill 0.3)
  Top 0.15: v92.66,13.4 92.03,12.77 83.24,12.77 80.74,15.27 80.74,15.61 J4.24 | v94.46,15.2 94.46,20.04 93.92,20.58 C17.2
  Bottom 0.15: v94.46,15.2 v92.66,13.4
N$102
  Top 0.15: C25.1 53.88,98.99 51.94,98.99 50.69,100.23 IC2.5
PREVGH  (via drill 0.3)
  Top 0.15: v82.27,16.44 82.27,15.68 J4.21 | v87.32,19.91 88.02,20.6 C16.2 88.02,20.67 89.61,22.26 89.61,26.42 D5.1
  Bottom 0.15: v82.27,16.44 83.86,16.44 v87.32,19.91
PREVGL  (via drill 0.3)
  Top 0.15: v92.66,14.02 91.69,13.05 83.51,13.05 81.3,15.27 81.3,15.61 J4.23 | v92.66,20.32 92.45,20.32 92.1,20.67 92.02,20.67 C15.2 91.98,20.62 97.36,26 97.36,29.53 96.33,30.57 93.35,30.57 D3.2
  Bottom 0.15: v92.66,20.32 v92.66,14.02
RESE  (via drill 0.3)
  Top 0.15: v90.51,17.34 91.2,16.65 91.2,15.68 J4.3 | v76.31,22.4 75.76,22.4 75.48,22.68 Q3.2 75.41,22.75 74.03,24.13 72.16,24.13 R9.2
  Bottom 0.15: v90.51,17.34 85.45,22.4 v76.31,22.4
RESE'
  Top 0.15: SJ1.2 65.86,32.99 66.06,33.2 71.6,33.2 R5.2 71.4,33.13 71.4,23.71 72.09,23.02 72.09,22.88 R9.1
RESET  (via drill 0.3)
  Top 0.15: v67.59,107.99 68.07,107.51 68.42,107.51 C26.1 | v66.96,108.62 66.06,109.52 65.92,109.52 U$1.3 65.86,109.58 U$1.4 | 48.68,100.31 49.17,100.31 56.78,107.92 59.9,107.92 R17.1 | 48.68,100.31 47.85,100.31 IC2.1 | v10.25,46.84 10.25,45.74 U1.3 | v48.68,100.23 48.68,100.31
  Bottom 0.15: v67.59,107.99 v66.96,108.62 57.13,108.62 48.75,100.23 v48.68,100.23 48.68,89.71 10.25,51.28 v10.25,46.84
RTC_RST  (via drill 0.3)
  Top 0.15: v23.89,62.01 22.99,62.91 U1.16 | v83.45,62.01 83.45,61.53 84.07,60.9 U6.4
  Bottom 0.15: v83.45,62.01 v23.89,62.01
RX
  Top 0.15: U1.24 12.88,63.26 12.88,71.91 24.29,83.32 TP2.TP
SCK  (via drill 0.3)
  Top 0.15: v85.87,16.44 86.22,16.1 86.22,15.68 J4.13 | v46.46,19.98 45.08,19.98 R29.1 | v46.81,55.64 46.81,56.26 U3.6 | v47.3,26 44.66,26 D9.2 44.6,26 v41.55,26 | v6.51,89.02 5.4,90.12 5.12,90.12 J2.P5 | v9.42,47.81 12.19,47.81 14.06,45.94 14.06,45.74 U1.6 | TP8.TP 76.91,104.64 69.94,97.67 v47.5,97.67
  Bottom 0.15: v85.87,16.44 84.69,16.44 83.93,15.68 78.04,15.68 73.57,20.15 69.51,20.15 69.33,19.98 47.37,19.98 | v46.46,19.98 47.37,19.98 | v46.81,55.64 46.81,54.67 47.37,54.12 47.37,26 | 47.37,19.98 47.37,26 | v47.3,26 47.37,26 | v47.5,97.67 20.36,97.67 11.7,89.02 v6.51,89.02 6.51,86.87 5.82,86.18 5.82,64.64 9.42,61.04 v9.42,47.81 9.42,47.74 9.28,47.61 9.28,46.78 9.97,46.08 15.79,46.08 35.87,26 v41.55,26
SCL  (via drill 0.3, 0.35)
  Top 0.15: 154.88,14.61 154.56,14.92 U5.4 | 154.88,14.61 158.1,11.39 158.1,5.71 157.96,5.57 152.69,5.57 151.86,6.4 150.69,6.4 R12.1 | v162.81,20.25 164.4,20.25 J3.4 | 154.88,14.61 v155.19,14.92 | v24.72,57.16 23.68,57.16 17.93,62.91 17.93,63.19 U1.20 | v87.25,52.73 87.25,52.18 87.88,51.55 U6.16
  Top 0.152: U2.7 136.33,60.17 136.6,59.9 v136.6,51.5
  Bottom 0.15: v162.81,20.25 160.52,20.25 v155.19,14.92 149.58,14.92 117.24,47.26 101.03,47.26 95.56,52.73 v87.25,52.73 79.5,60.49 35.73,60.49 32.41,57.16 v24.72,57.16
  Bottom 0.152: v136.6,51.5 136.6,36 149.4,23.2 149.4,16.7 150.5,15.6 151.1,15.6 151.45,15.95 151.59,15.95 151.74,16.1 154,16.1 154.1,16.2 154.8,16.2 155.2,15.8 155.2,14.93 v155.19,14.92
SDA  (via drill 0.3, 0.35)
  Top 0.15: 149.99,13.88 149.99,7.3 150.13,7.16 151.52,7.16 152.21,6.47 152.9,6.47 R13.1 | 149.99,13.88 151.86,15.75 | 153.73,15.27 153.73,14.99 U5.3 153.8,15.27 154.79,16.25 156.34,16.25 156.64,15.95 v156.64,15.75 | v163.36,19.7 163.78,19.28 164.4,19.28 J3.3 | v35.87,60 v26.31,60 | U1.19 19.18,63.19 19.18,62.69 21.77,60.1 v21.77,59.89 | U6.15 86.56,51.55 86.42,51.69 v86.42,52.94 86.35,52.8 85.04,52.8 84.83,52.59 84.83,50.45 84.97,50.31 85.59,50.31 87.81,48.09 87.81,47.12 121.05,13.88 149.99,13.88
  Top 0.152: 153.73,15.27 153.25,15.75 152.81,15.75 151.86,15.75 | U5.3 153.75,16.09 153.44,16.4 v151.4,16.4 | v136.6,60.6 135.46,60.6 U2.8
  Bottom 0.15: v163.36,19.7 160.59,19.7 v156.64,15.75 | v26.31,60 21.88,60 v21.77,59.89 | v35.87,60 79.36,60 v86.42,52.94
  Bottom 0.152: v151.4,16.4 151.4,18.7 150.3,19.8 150.3,38.3 148.9,39.7 143.1,39.7 139.8,43 139.8,60.3 139.5,60.6 v136.6,60.6
SRC  (via drill 0.3)
  Top 0.15: C7.2 96.6,27.73 94.46,27.73 93.21,26.48 D5.2 93.14,26.48 v90.65,26.48 | Q3.3 77.56,23.71 77.56,25.03 82.34,29.81 L1.1 84.83,29.84 v85.55,30.56
  Bottom 0.15: v90.65,26.48 89.63,26.48 v85.55,30.56
SS_SD  (via drill 0.3)
  Top 0.15: 40.86,48.37 41.69,48.37 D12.2 | 40.86,48.37 40.02,48.37 R26.1 | v6.3,86.04 5.54,86.8 J2.P2 | v9.76,47.33 10.39,47.33 11.49,46.22 11.49,45.74 U1.4 | v40.86,48.44 40.86,48.37
  Bottom 0.15: v6.3,86.04 6.3,64.57 9.9,60.97 9.9,47.47 v9.76,47.33 9.76,46.71 10.11,46.36 27.84,46.36 30.12,48.64 38.64,48.64 38.85,48.44 v40.86,48.44
TX
  Top 0.15: U1.25 11.56,63.26 11.56,75.58 20.41,84.44 TP1.TP
USB_D+  (via drill 0.3)
  Top 0.15: v104.91,64.57 136.76,64.57 145.83,55.5 148.61,55.5 D1.1 | v17.52,51.21 18.97,51.21 24.24,45.94 24.24,45.74 U1.14
  Bottom 0.15: v104.91,64.57 25.83,64.57 17.52,56.26 v17.52,51.21
USB_D-  (via drill 0.3)
  Top 0.15: v17.03,50.86 17.24,50.86 21.4,46.71 22.23,46.71 22.92,46.01 22.92,45.74 U1.13 | D1.3 148.57,53.63 v137.98,53.63
  Bottom 0.15: v17.03,50.86 17.03,56.19 25.9,65.06 110.94,65.06 122.36,53.63 v137.98,53.63
VBAT
  Top 0.3: TP3.TP 105.33,62.35 108.86,58.82 109.17,58.82 C10.1 109.33,59 110.54,57.79 121.88,57.79 122.36,58.27 122.71,58.27 U4.3 122.85,58.34 123.19,58.34 126.93,54.6 | U2.2 133.44,60.14 133.44,59.72 U2.3 133.31,59.59 131.99,59.59 127.07,54.67 126.93,54.6 | 126.93,54.6 126.93,53.56 Q1.3
VBUS
  Top 0.3: 116.86,61.7 118.21,63.05 TP14.TP | C9.1 114.42,58.8 114.61,58.92 114.61,59.68 114.44,59.85 114.44,60.26 114.74,60.56 115.72,60.56 116.86,61.7 | 116.86,61.7 120.15,58.41 U4.4 120.36,58.34 121.53,58.34 123.26,60.07 131.92,60.07 133.86,62.01 137.47,62.01 137.47,51.88 138.63,50.72 | C2.1 149.79,48.51 149.79,50.79 C1.1 | D1.5 151.1,54.46 150.69,54.46 149.93,53.7 149.93,50.93 C1.1 | 138.63,50.72 126.87,50.72 126.17,51.41 Q1.1 125.96,51.55 119.87,51.55 118.55,52.87 LED1.A 118.42,52.94 117.45,52.94 113.64,49.13 D2.2 113.71,48.99 114.95,47.74 114.95,44.35 R4.2 115.09,44.21 117.1,42.2 147.5,42.2 150.06,44.77 150.96,44.77 R2.2 | 138.63,50.72 149.65,50.72 C1.1
VRTC
  Top 0.3: U6.14 85.38,51.48 85.38,51.07 88.5,47.95 88.5,47.54 C23.1 88.71,47.54 98.75,47.54 129.13,17.15 153.19,17.15 153.66,16.68 165.26,16.68 165.51,16.93 165.51,60.28 160.45,65.33 102.97,65.33 96.08,58.44 | 96.08,58.44 97.64,56.89 97.64,55.78 C24.1 | 96.08,58.44 91.41,63.12 R14.2
VUSB
  Top 0.3: J1.A9 163.64,56.47 163.64,56.26 J1.B4 163.78,56.19 164.26,56.19 164.47,55.98 164.47,51.9 164.33,51.76 163.78,51.76 J1.B9 163.64,51.69 163.64,51.41 J1.A4 163.5,51.34 157.68,51.34 153.73,47.4 149.09,47.4 146.53,44.84 R2.1

## Text on the board
tNames: SCK | INT_RTC | 3V3 | MISO | MOSI | TX | RX | EPD_3V3_C | GND_1 | GND_2 | EPD_RST | VBUS | VBAT | EPD_DC | EPD_BUSY | EPD_CS | EPD_3V3